# Altium schematic sheet SingleBoardCircuitRev2.SchDoc
size B; Date: 2/10/2009; ApprovedBy: Touraj; DrawnBy: Juan A. Nadal; Engineer: Touraj; Organization: ActiveWave; Address1: 902 Clint Moore Rd., Suite 118; Address2: Boca Raton; Address3: FL, 33487; Address4: 561-999-9422; DocumentNumber: 3; Revision: 21; SheetNumber: 3; SheetTotal: 4; PageSetup: Record=PageOptions|CenterHorizontal=True|CenterVertical=True|PrintScale=0.70|XCorrection=1.00|YCorrection=1.00|PrintKind=0|BorderSize=5000000|LeftOffset=0|BottomOffset=0|Orientation=2|PaperLength=1000|PaperWidth=1000|Scale=100|PaperSource=7|PrintQuality=-4|MediaType=1|DitherType=10|PaperKind=Letter|PrintScaleMode=1; Project: Tag105
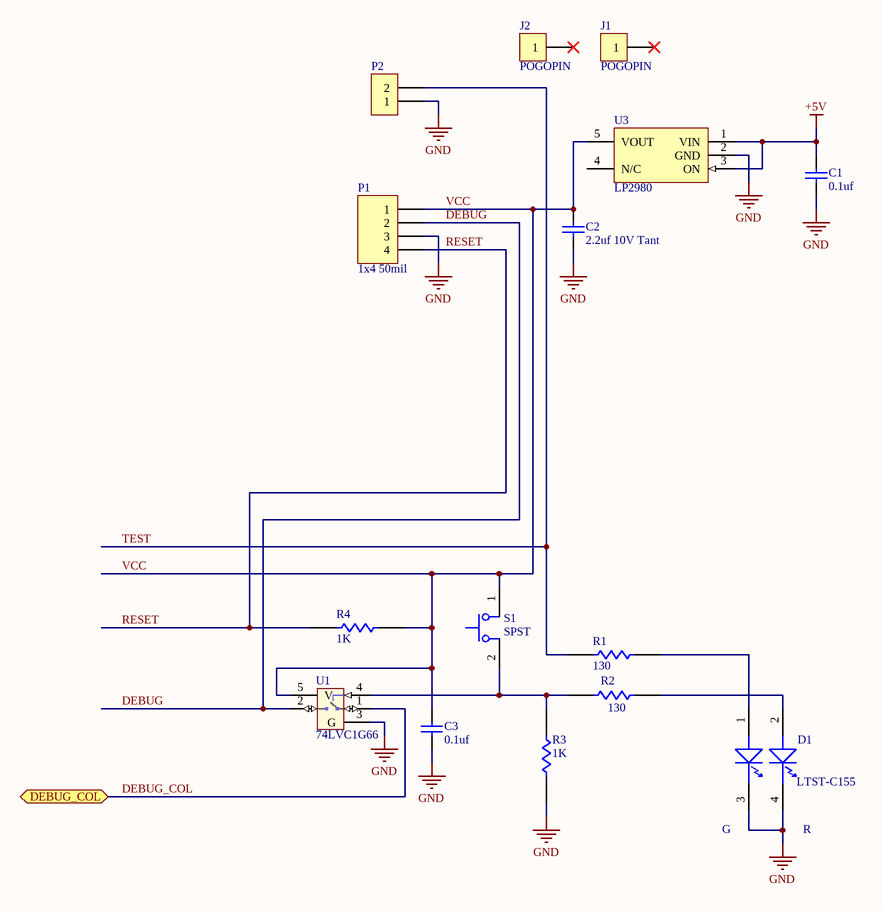
[diagram p0: SingleBoardCircuitRev2.SchDoc]

## Parts
C1  0.1uf  [0603_072205]
C2  2.2uf 10V Tant  [CAP A CASE_030205]
C3  0.1uf  [0603_072205]
D1  LTST-C155  [LED 5mm x 2.5mm_061112]
J1  POGOPIN  [TestPoint52x32]
J2  POGOPIN  [TestPoint52x32]
P1  1x4 50mil  [1X4 HEADER_50mil_071411]
P2  1x2 50mil  [1X2 HEADER_50MIL_081611]  (value not drawn)
R1  130  [0603_072205]
R2  130  [0603_072205]
R3  1K  [0603_072205]
R4  1K  [0603_072205]
S1  SPST  [SwitchDPDT_6_061412]
U1  74LVC1G66  [SOT25_030205]
U3  LP2980  [SOT25_030205]

## Ports
DEBUG_COL (bidir)

## Nets
+5V: C1.1 U3.1(VIN) U3.3(ON)
GND: C1.2 C2.2 C3.2 D1.3(K) D1.4(K) P1.3 P2.1 R3.1 U1.3(G) U3.2(GND)
DEBUG: P1.2 U1.2(OUTY)
DEBUG_COL: U1.1(INA) ; port DEBUG_COL
RESET: P1.4 R4.1
TEST: P2.2 R1.2
VCC: C2.1 C3.1 P1.1 R4.2 S1.1 U1.5(V) U3.5(VOUT)
NetD1_1: D1.1(G) R1.1
NetD1_2: D1.2(R) R2.1
NetR2_2: R2.2 R3.2 S1.2 U1.4(EN)

Not connected (* = marked no-connect by the designer): J1 1*; J2 1*; U3 4(N/C)

## Notes on the sheet
- (near D1) G
- (near D1) R
- APPROVALS
- DATE
- Title:
- Drawn:
- Checked:
- Release:
- Date:
- Size:
- Sheet Name:
- B
- Number:
- Time:
- Revision:
- Sheet
- of
- File:

## Library data of the parts
C1 C3 = Cap: Capacitor; PARTNO: C0603C104Z3VACTU; MAN: Kemet; VALUE: 0.1uf; DK: 399-1100-2-ND
C2 = Cap: Capacitor; PARTNO: F931A225MAA; MAN: Nichicon; VALUE: 2.2uf 10V Tant; DK: 493-2356-1-ND
D1 = LED_BI_2_1: PARTNO: LTST-C155GEKT; VALUE: LTST-C155; DK: 160-1172-2-ND
J1 J2 = CON1: Connector; VALUE: POGOPIN; DK: N/A; MAN: N/A; PARTNO: N/A
P1 = Header 4: Header, 4-Pin; VALUE: 1x4 50mil; DK: 4 PogoPins
P2 = CON2: DK: 2 PogoPins; VALUE: 1x2 50mil
R1 R2 = RESISTOR: PARTNO: MCR03EZPFX1300; MAN: Rohm; VALUE: 130; DK: RHM130HTR-ND
R3 R4 = RESISTOR: PARTNO: MCR03EZPFX1001; MAN: Rohm; VALUE: 1K; DK: RHM1.00KHTR-ND
S1 = SWITCH PB: PARTNO: PVA2 EE H1; VALUE: SPST; DK: 401-1140-ND
U1 = 7466_SINGLE: Single Solid State Switch; PARTNO: SN74LVC1G66DBVR; VALUE: 74LVC1G66; DK: 296-13253-1-ND
U3 = LP2985: PARTNO: LP2980AIM5-3.3/NOPB; MAN: TI / National; VALUE: LP2980; DK: LP2980AIM5-3.3CT-ND